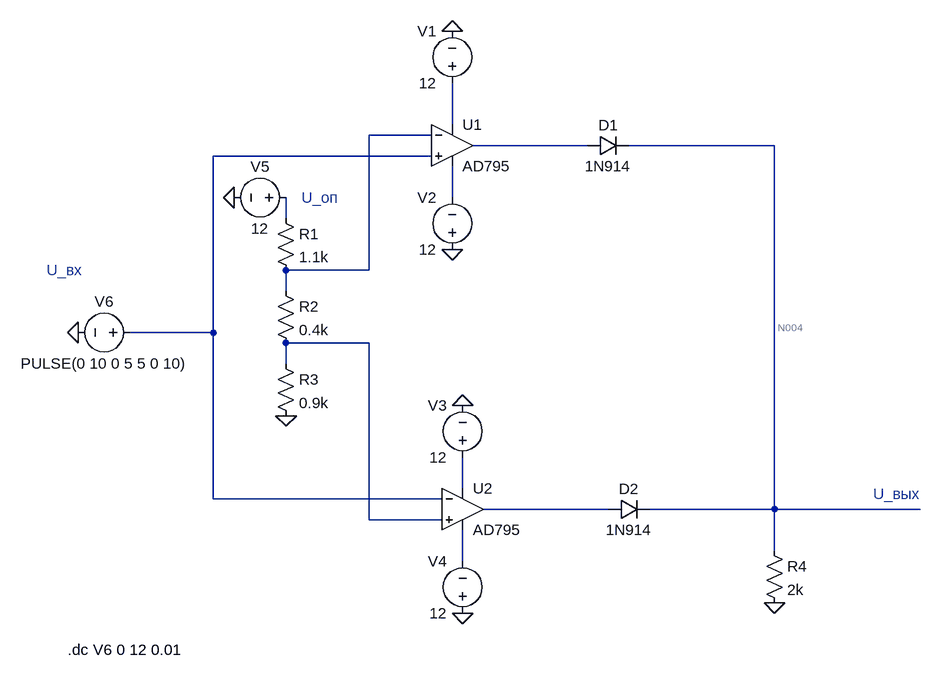
[diagram p0: schematic task34.asc]
task34.asc, the LTspice schematic file:
Version 4.1
SHEET 1 908 952
WIRE 176 128 176 64
WIRE 144 144 48 144
WIRE 384 160 208 160
WIRE 672 160 448 160
WIRE 144 176 -192 176
WIRE 176 240 176 192
WIRE -80 272 -80 240
WIRE 48 352 48 144
WIRE 48 352 -80 352
WIRE -80 384 -80 352
WIRE -192 448 -192 176
WIRE -192 448 -320 448
WIRE 48 464 -80 464
WIRE -80 496 -80 464
WIRE 192 688 192 640
WIRE -192 704 -192 448
WIRE 160 704 -192 704
WIRE 416 720 224 720
WIRE 672 720 672 160
WIRE 672 720 480 720
WIRE 896 720 672 720
WIRE 48 736 48 464
WIRE 160 736 48 736
WIRE 672 784 672 720
WIRE 192 800 192 752
FLAG 672 864 0
FLAG -80 576 0
FLAG 192 560 0
FLAG 192 880 0
FLAG 176 320 0
FLAG 176 -16 0
FLAG -160 240 0
FLAG -400 448 0
SYMBOL OpAmps\\AD795 176 96 R0
SYMATTR InstName U1
SYMBOL OpAmps\\AD795 192 656 R0
SYMATTR InstName U2
SYMBOL diode 384 176 R270
WINDOW 0 32 32 VTop 2
WINDOW 3 0 32 VBottom 2
SYMATTR InstName D1
SYMATTR Value 1N914
SYMBOL diode 416 736 R270
WINDOW 0 32 32 VTop 2
WINDOW 3 0 32 VBottom 2
SYMATTR InstName D2
SYMATTR Value 1N914
SYMBOL res -96 256 R0
SYMATTR InstName R1
SYMATTR Value 1.1k
SYMBOL res -96 368 R0
SYMATTR InstName R2
SYMATTR Value 0.4k
SYMBOL res -96 480 R0
SYMATTR InstName R3
SYMATTR Value 0.9k
SYMBOL res 656 768 R0
SYMATTR InstName R4
SYMATTR Value 2k
SYMBOL voltage 176 80 R180
WINDOW 0 24 96 Left 2
WINDOW 3 24 16 Left 2
SYMATTR InstName V1
SYMATTR Value 12
SYMBOL voltage 176 336 R180
WINDOW 0 24 96 Left 2
WINDOW 3 24 16 Left 2
SYMATTR InstName V2
SYMATTR Value 12
SYMBOL voltage 192 656 R180
WINDOW 0 24 96 Left 2
WINDOW 3 24 16 Left 2
SYMATTR InstName V3
SYMATTR Value 12
SYMBOL voltage 192 896 R180
WINDOW 0 24 96 Left 2
WINDOW 3 24 16 Left 2
SYMATTR InstName V4
SYMATTR Value 12
SYMBOL voltage -64 240 R90
WINDOW 0 -32 56 VBottom 2
WINDOW 3 32 56 VTop 2
SYMATTR InstName V5
SYMATTR Value 12
SYMBOL voltage -304 448 R90
WINDOW 0 -32 56 VBottom 2
WINDOW 3 32 56 VTop 2
SYMATTR InstName V6
SYMATTR Value PULSE(0 10 0 5 5 0 10)
TEXT 824 696 Left 2 ;U_вых
TEXT -448 352 Left 2 ;U_вх
TEXT -56 240 Left 2 ;U_оп
TEXT -416 936 Left 2 !.dc V6 0 12 0.01

The netlist it stands for:
* task34.asc
X§U1 N005 N002 N001 N006 N003 AD795  ; pins In+ In- V+ V- OUT
X§U2 N008 N005 N009 N011 N010 AD795  ; pins In+ In- V+ V- OUT
D1 N003 N004 1N914
D2 N010 N004 1N914
R1 N007 N002 1.1k
R2 N002 N008 0.4k
R3 N008 0 0.9k
R4 N004 0 2k
V1 N001 0 12
V2 0 N006 12
V3 N009 0 12
V4 0 N011 12
V5 N007 0 12
V6 N005 0 PULSE(0 10 0 5 5 0 10)
.model D D
.lib standard.dio
* U_вых
* U_вх
* U_оп
.dc V6 0 12 0.01
.lib ADI1.lib
.backanno
.end

* Results of the author's LTspice run, read from the files saved beside the schematic
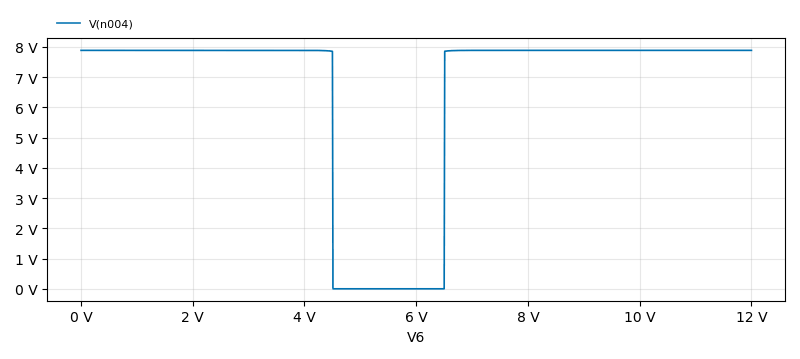
[diagram p1: DC transfer characteristic of task34.asc, plotted from the saved traces]
* DC transfer characteristic, 1 run:
*   V(n004): 7.886 V at V6=0 V, 7.886 V at V6=12 V, min -10.12 µV, max 7.886 V